# EasyEDA Pro project ProPrj_MambaQuad_2026-04-23.epro, board RC BTN
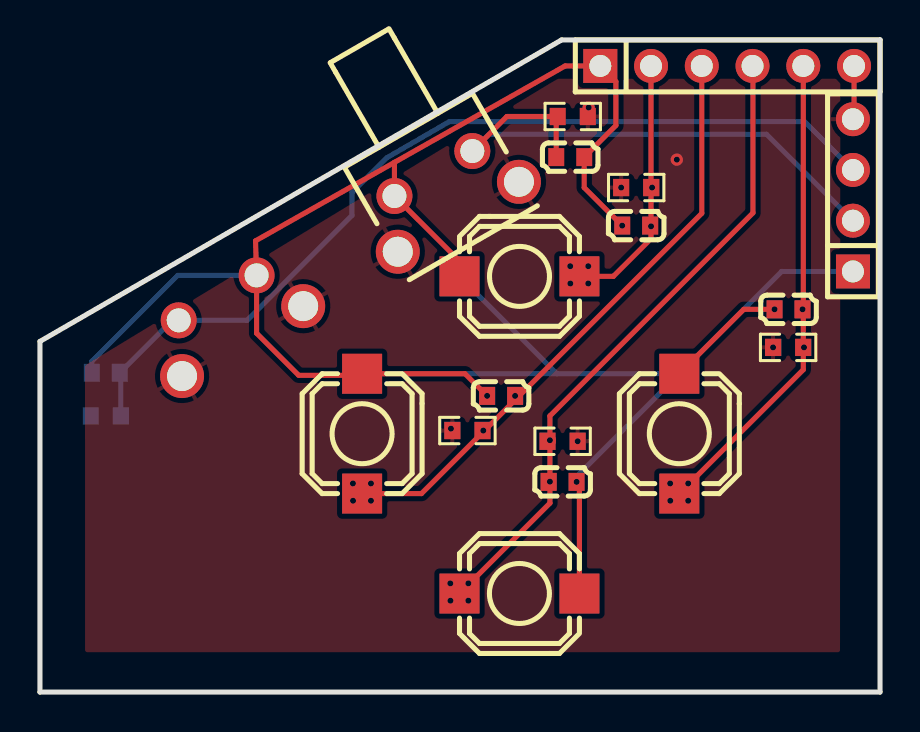
[diagram p12: board, top side]
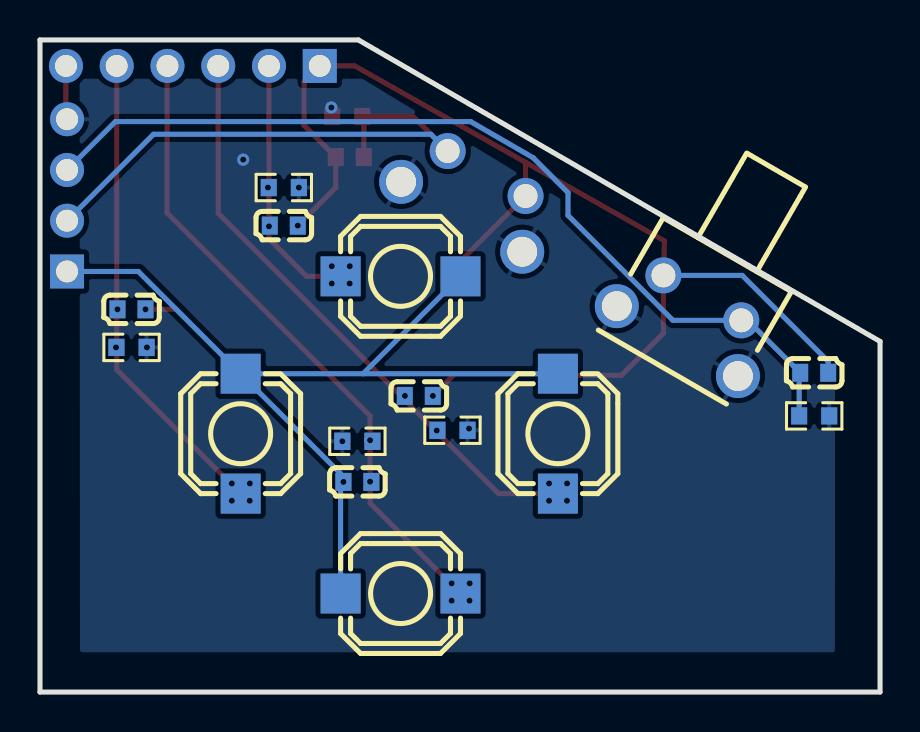
[diagram p13: board, bottom side, seen from below]

Outline 42.04 x 32.64 mm; copper layers: Top Layer, Bottom Layer. Coordinates in mm from the lower left corner of the outline.
Outline path: 0,17.55 26.1,32.64 42.04,32.64 42.04,0 0,0 0,17.55
Stack: Top Layer 0.035mm / Dielectric1 1.51mm FR4 er 4.5 / Bottom Layer 0.035mm

## Design rules (mm)
spacing copperThickness1oz (default): track to track 0.102, other pairs 0.152 to 0.3
spacing copperThickness2oz: track to track 0.203, other pairs 0.152 to 0.3
track width copperThickness1oz (default): min 0.127, default 0.254, max 2.54
track width copperThickness2oz: min 0.203, default 0.254, max 2.54
differential pair differentialPair (default): width min 0.127, default 0.254, max 2.54; gap min 0.152, default 0.152
net GND uses copperRegion

## Placement (name value [footprint] x y rotation side)
C1  100nF  [C0603_1]  26.54 26.78 0 top
C2  100nF  [C0603_1]  3.29 15.98 180 bottom
C3  100nF  [C0603_1]  29.84 23.35 180 top
C4  100nF  [C0603_1]  29.84 23.35 180 bottom
C5  100nF  [C0603_1]  37.46 19.16 180 top
C6  100nF  [C0603_1]  37.46 19.16 180 bottom
C7  100nF  [C0603_1]  26.15 10.52 0 top
C8  100nF  [C0603_1]  26.15 10.52 0 bottom
C9  100nF  [C0603_1]  23.08 14.82 180 top
C10  100nF  [C0603_1]  23.08 14.82 180 bottom
H1  PZ254V-11-04P  [HDR-TH_4P-P2.54-V-M]  40.68 24.86 90 top
H2  PZ254V-11-06P  [HDR-TH_6P-P2.54-V-M]  34.39 31.34 0 top
R1  10kΩ  [R0603]  26.66 28.81 0 top
R2  10kΩ  [R0603]  3.29 13.82 180 bottom
R3  10kΩ  [R0603]  29.84 25.25 180 top
R4  10kΩ  [R0603]  29.84 25.25 180 bottom
R5  10kΩ  [R0603]  37.44 17.25 180 top
R6  10kΩ  [R0603]  37.46 17.25 180 bottom
R7  10kΩ  [R0603]  26.15 12.55 0 top
R8  10kΩ  [R0603]  26.15 12.55 0 bottom
R9  10kΩ  [R0603]  21.39 13.09 180 top
R10  10kΩ  [R0603]  21.4 13.11 180 bottom
SW1  OS4D501110  [SW-SMD_L6.0-W6.0-P6.00-LS6.8]  24 20.81 0 top
SW2  OS4D501110  [SW-SMD_L6.0-W6.0-P6.00-LS6.8]  32 12.93 270 top
SW3  OS4D501110  [SW-SMD_L6.0-W6.0-P6.00-LS6.8]  24 4.93 180 top
SW4  OS4D501110  [SW-SMD_L6.0-W6.0-P6.00-LS6.8]  16.12 12.93 270 top
SW5  OS4D501110  [SW-SMD_L6.0-W6.0-P6.00-LS6.8]  24 20.81 0 bottom
SW6  OS4D501110  [SW-SMD_L6.0-W6.0-P6.00-LS6.8]  32 12.93 270 bottom
SW7  OS4D501110  [SW-SMD_L6.0-W6.0-P6.00-LS6.8]  24 4.93 180 bottom
SW8  OS4D501110  [SW-SMD_L6.0-W6.0-P6.00-LS6.8]  16.12 12.93 270 bottom
SW11  TC-1102N-C-CL-B  [SW-TH_TC-1102N-C-CL-B]  20.31 24.87 210 top
SW12  TC-1102N-C-CL-B  [SW-TH_TC-1102N-C-CL-B]  9.52 18.65 30 bottom

## Footprints (pads in the part's own frame, mm; a bottom-side part is the same pattern mirrored in y, then rotated)
C0603_1
  rect 0.8x0.9 smd: 1(-0.7,0) 2(0.7,0)
HDR-TH_4P-P2.54-V-M
  rect 1.7x1.7 hole 1.1: 1(-3.81,0)
  round 1.7 hole 1.1: 2(-1.27,0) 3(1.27,0) 4(3.81,0)
HDR-TH_6P-P2.54-V-M
  rect 1.7x1.7 hole 1.1: 1(-6.35,0)
  round 1.7 hole 1.1: 2(-3.81,0) 3(-1.27,0) 4(1.27,0) 5(3.81,0) 6(6.35,0)
R0603
  rect 0.806x0.864 smd: 1(-0.753,0) 2(0.753,0)
SW-SMD_L6.0-W6.0-P6.00-LS6.8
  rect 2x2 smd: 1(-3,0) 2(3,0)
SW-TH_TC-1102N-C-CL-B
  round 1.8 hole 1.2: 1(-2.25,-1.25) 2(2.25,-1.25)
  round 2.2 hole 1.5: 3(3.5,1.25) 4(-3.5,1.25)

## Nets
As in the schematic.

## Via types
v1: diameter 0.61, hole 0.305, Top Layer to Bottom Layer, 34 vias

## Routing (per net, layer and track width the routed paths; a pad name or vN(x,y) marks a point on that pad's centre or on a via; arc(x,y) is an arc through that point)
GND: length 2.7
  Top Layer w0.254: H2.6 40.74,28.73 H1.4
  vias: v1(20.57,13.19) v1(26.91,12.55) v1(27.46,29.26) v1(29.08,25.25) v1(31.87,26.65) v1(36.69,17.25)
VCC: length 122.9
  Top Layer w0.254: 17.75,26.52 17.74,26.51 SW11.2 21,21.57 SW1.1 ; v1(36.76,19.16) 35.22,19.16 SW2.1 ; v1(29.14,23.35) 27.24,25.25 C1.2 28.82,28.36 28.82,30.56 H2.1 26.28,31.34 10.79,22.58 SW12.2 10.84,17.96 12.95,15.85 16.04,15.85 SW4.1 21.27,15.93 v1(22.38,14.82) ; SW3.1 27,10.38 v1(26.85,10.52)
  Bottom Layer w0.254: C2.2 2.59,16.55 6.9,20.86 SW12.2 ; SW3.1 27,10.93 SW2.1 ; SW2.1 25.87,15.93 ; SW2.1 37.12,21.05 H1.1 ; SW1.1 25.87,15.93 SW4.1
BUTTON1: length 13
  Top Layer w0.254: SW1.2 28.69,20.81 30.58,22.69 v1(30.58,23.31) H2.2
  vias: v1(26.54,21.31) v1(26.54,20.45) v1(27.44,21.31) v1(27.44,20.45) v1(30.63,25.25)
BUTTON2: length 24
  Top Layer w0.254: H2.5 38.2,16.14 SW2.2
  vias: v1(31.54,10.44) v1(31.54,9.58) v1(32.44,10.44) v1(32.44,9.58) v1(38.16,19.16) v1(38.23,17.25)
BUTTON3: length 32.5
  Top Layer w0.254: SW3.2 25.52,9.46 v1(25.52,10.53) v1(25.52,12.6) 25.52,13.82 35.68,23.98 35.68,31.32 H2.4
  vias: v1(20.54,5.44) v1(20.54,4.57) v1(21.44,5.44) v1(21.44,4.57)
BUTTON4: length 30.2
  Top Layer w0.254: H2.3 33.12,23.96 19.09,9.93 SW4.2
  vias: v1(15.66,10.44) v1(15.67,9.58) v1(16.56,10.44) v1(16.56,9.58) v1(22.19,13.09) v1(23.78,14.82)
SIDEBUTTON1: length 28.2
  Top Layer w0.254: SW11.1 23.37,28.81 R1.1 25.84,28.73 C1.1
  Bottom Layer w0.254: H1.2 36.36,27.92 22.48,27.92 SW11.1
SIDEBUTTON2: length 45.5
  Bottom Layer w0.254: R2.1 4.05,15.93 C2.1 6.62,18.61 SW12.1 10.36,18.61 15.61,23.85 15.61,25 17.36,26.75 20.49,28.55 38.26,28.55 H1.3

## Copper pours and planes (outline as drawn; the poured copper is in the pictures)
GND on Top Layer: -1.91,36.3 42.79,36.3 42.79,-2.43 -1.91,-2.43
GND on Bottom Layer: -2.17,35.67 44.19,35.67 44.19,-2.56 -2.17,-2.56
